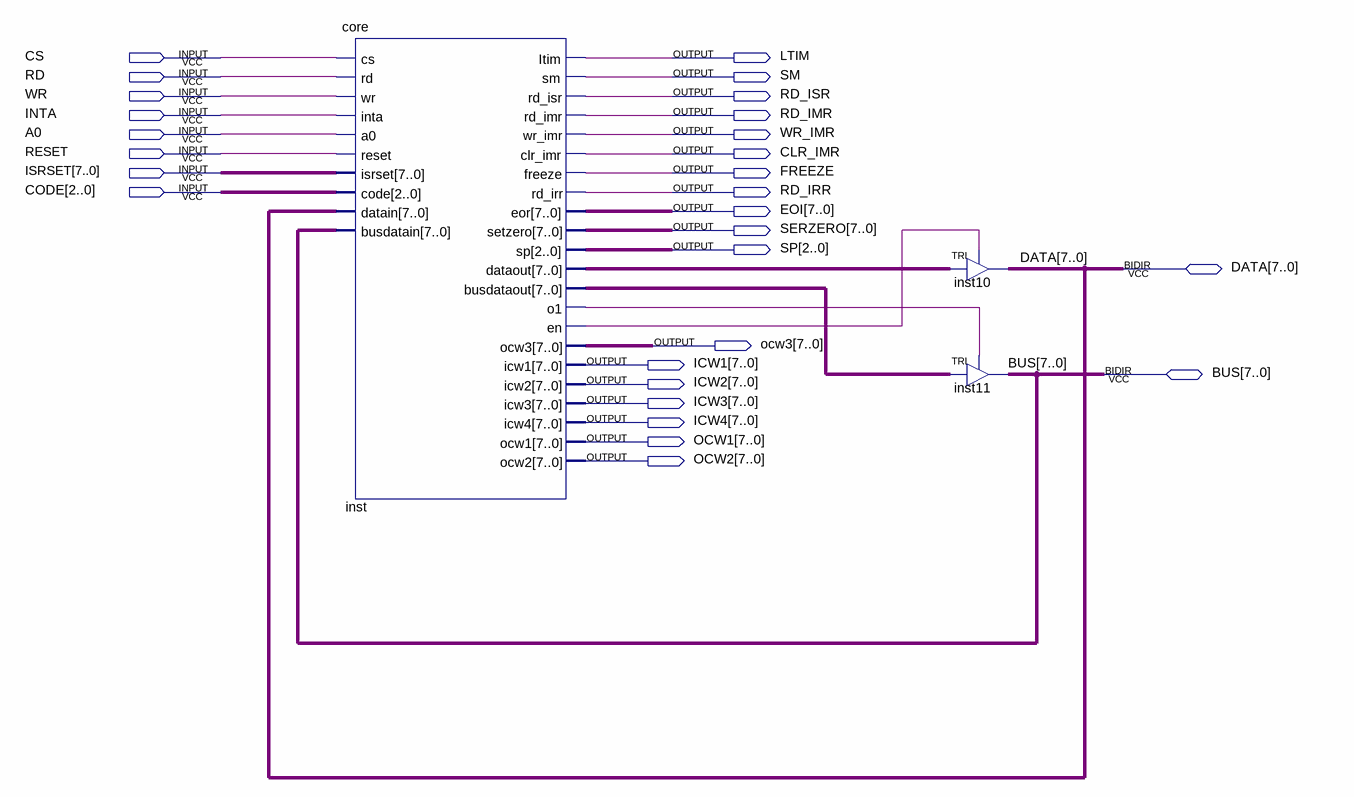
[diagram p0: schematic sheet]
// Quartus schematic CORE_FINAL.bdf as structural Verilog: 3 symbols, 28 pins
module CORE_FINAL (
  input  CS,
  input  RD,
  input  WR,
  input  INTA,
  input  A0,
  input  RESET,
  input  [7:0] ISRSET,
  input  [2:0] CODE,
  inout  [7:0] DATA,
  inout  [7:0] BUS,
  output LTIM,
  output SM,
  output RD_ISR,
  output RD_IMR,
  output WR_IMR,
  output CLR_IMR,
  output FREEZE,
  output RD_IRR,
  output [7:0] EOI,
  output [7:0] SERZERO,
  output [2:0] SP,
  output [7:0] ocw3,
  output [7:0] ICW1,
  output [7:0] ICW2,
  output [7:0] ICW3,
  output [7:0] ICW4,
  output [7:0] OCW1,
  output [7:0] OCW2
);

  wire inst_en, inst_o1;
  wire [7:0] inst_busdataout, inst_dataout;

  core inst (
    .cs(CS), .rd(RD), .wr(WR), .inta(INTA), .a0(A0), .reset(RESET), .isrset(ISRSET), .code(CODE),
    .datain(DATA), .busdatain(BUS), .Itim(LTIM), .sm(SM), .rd_isr(RD_ISR), .rd_imr(RD_IMR), .wr_imr(WR_IMR),
    .clr_imr(CLR_IMR), .freeze(FREEZE), .rd_irr(RD_IRR), .eor(EOI), .setzero(SERZERO), .sp(SP),
    .dataout(inst_dataout), .busdataout(inst_busdataout), .o1(inst_o1), .en(inst_en), .ocw3(ocw3),
    .icw1(ICW1), .icw2(ICW2), .icw3(ICW3), .icw4(ICW4), .ocw1(OCW1), .ocw2(OCW2));
  TRI inst10[7:0] (.IN(inst_dataout), .OE(inst_en), .OUT(DATA));
  TRI inst11[7:0] (.IN(inst_busdataout), .OE(inst_o1), .OUT(BUS));
endmodule
